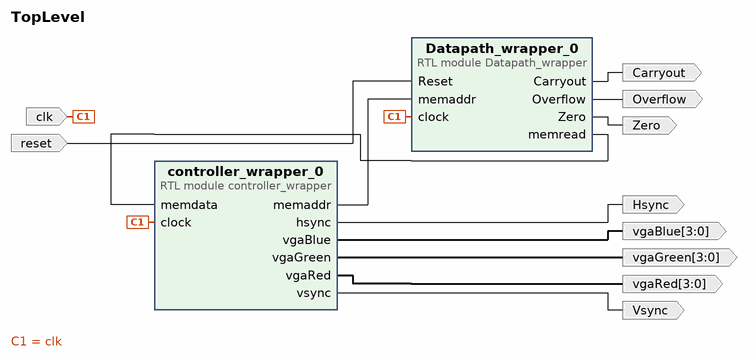
[diagram p0: block diagram of the top level]
# Vivado block design TopLevel, xc7a35tcpg236-1, Vivado 2022.2
create_bd_design TopLevel

create_bd_port -dir I -type clk clk
set_property -dict {CONFIG.FREQ_HZ 100000000} [get_bd_ports clk]
create_bd_port -dir O -from 3 -to 0 vgaRed
create_bd_port -dir O -from 3 -to 0 vgaGreen
create_bd_port -dir O -from 3 -to 0 vgaBlue
create_bd_port -dir O Hsync
create_bd_port -dir O Vsync
create_bd_port -dir I reset
create_bd_port -dir O Carryout
create_bd_port -dir O Zero
create_bd_port -dir O Overflow

create_bd_cell -type module -reference controller_wrapper controller_wrapper_0
create_bd_cell -type module -reference Datapath_wrapper Datapath_wrapper_0

# ---- connections ----

connect_bd_net [get_bd_pins Datapath_wrapper_0/Carryout] [get_bd_ports Carryout]
connect_bd_net [get_bd_pins Datapath_wrapper_0/Overflow] [get_bd_ports Overflow]
connect_bd_net [get_bd_pins Datapath_wrapper_0/Zero] [get_bd_ports Zero]
connect_bd_net [get_bd_pins Datapath_wrapper_0/memread] [get_bd_pins controller_wrapper_0/memdata]
connect_bd_net -net clock_1 [get_bd_ports clk] [get_bd_pins controller_wrapper_0/clock] [get_bd_pins Datapath_wrapper_0/clock]
connect_bd_net [get_bd_pins controller_wrapper_0/hsync] [get_bd_ports Hsync]
connect_bd_net [get_bd_pins controller_wrapper_0/memaddr] [get_bd_pins Datapath_wrapper_0/memaddr]
connect_bd_net [get_bd_pins controller_wrapper_0/vgaBlue] [get_bd_ports vgaBlue]
connect_bd_net [get_bd_pins controller_wrapper_0/vgaGreen] [get_bd_ports vgaGreen]
connect_bd_net [get_bd_pins controller_wrapper_0/vgaRed] [get_bd_ports vgaRed]
connect_bd_net [get_bd_pins controller_wrapper_0/vsync] [get_bd_ports Vsync]
connect_bd_net [get_bd_ports reset] [get_bd_pins Datapath_wrapper_0/Reset]

validate_bd_design
save_bd_design
